# Altium schematic sheet Linesensor.SchDoc
size A4; SheetNumber: 6; SheetTotal: 15
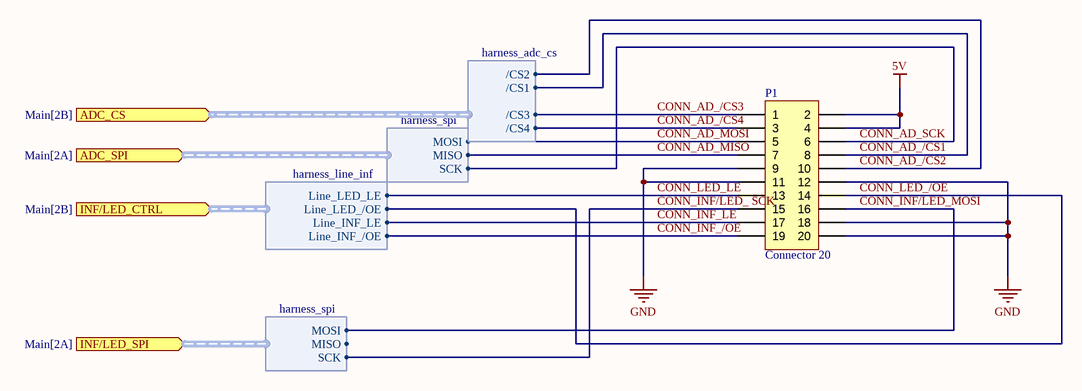
[diagram p0: Linesensor.SchDoc]

## Parts
P1  Connector 20  [CONNECTOR-20P]

## Ports
ADC_CS (in, harness harness_adc_cs, see Main[2B]), ADC_SPI (in, harness harness_spi, see Main[2A]), INF/LED_CTRL (in, harness harness_line_inf, see Main[2B]), INF/LED_SPI (in, harness harness_spi, see Main[2A])

## Harnesses
harness_line_inf: Line_LED_LE, Line_INF_LE, Line_INF_/OE, Line_LED_/OE
harness_spi: MOSI, MISO, SCK
harness_adc_cs: /CS2, /CS1, /CS3, /CS4

## Nets
5V: P1.2 P1.4
GND: P1.9 P1.11 P1.12 P1.18 P1.20
CONN_AD_/CS1: P1.8 ; port ADC_CS./CS1
CONN_AD_/CS2: P1.10 ; port ADC_CS./CS2
CONN_AD_/CS3: P1.1 ; port ADC_CS./CS3
CONN_AD_/CS4: P1.3 ; port ADC_CS./CS4
CONN_AD_MISO: P1.7 ; port ADC_SPI.MISO
CONN_AD_MOSI: P1.5 ; port ADC_SPI.MOSI
CONN_AD_SCK: P1.6 ; port ADC_SPI.SCK
CONN_INF/LED_ SCK: P1.15 ; port INF/LED_SPI.SCK
CONN_INF/LED_MOSI: P1.16 ; port INF/LED_SPI.MOSI
CONN_INF_/OE: P1.19 ; port INF/LED_CTRL.Line_INF_/OE
CONN_INF_LE: P1.17 ; port INF/LED_CTRL.Line_INF_LE
CONN_LED_/OE: P1.14 ; port INF/LED_CTRL.Line_LED_/OE
CONN_LED_LE: P1.13 ; port INF/LED_CTRL.Line_LED_LE

## Notes on the sheet
- Size
- Date
- A4
- Title
- Sheet number
- Author
- Revision

## Library data of the parts
P1 = Connector 20: Ribbon cable connector; Name: SZAL.KABEL 20 P APA 90° BHR-20 (T-T); Reference: 43-01-11; Supplier: Lomex